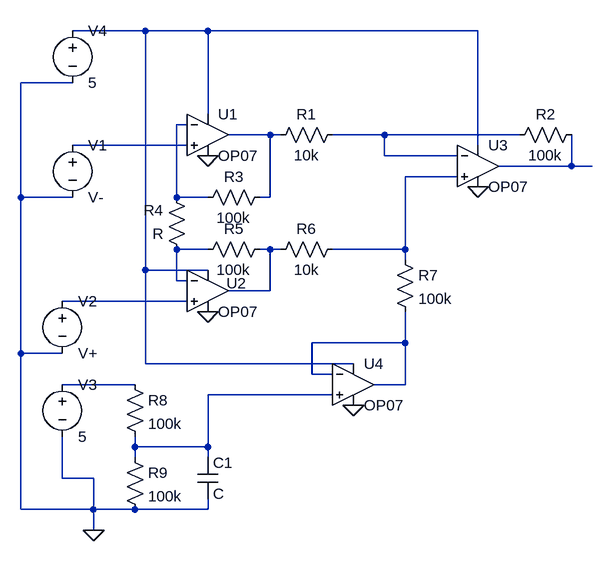
[diagram p0: schematic 4_instrumentation_amplifier.asc]
4_instrumentation_amplifier.asc, the LTspice schematic file:
Version 4.1
SHEET 1 880 864
WIRE -16 -80 -128 -80
WIRE 80 -80 -16 -80
WIRE 496 -80 80 -80
WIRE -128 0 -208 0
WIRE 80 48 80 -80
WIRE 48 64 32 64
WIRE 176 80 112 80
WIRE 192 80 176 80
WIRE 352 80 272 80
WIRE 560 80 352 80
WIRE 48 96 -128 96
WIRE 496 96 496 -80
WIRE 352 112 352 80
WIRE 464 112 352 112
WIRE 640 128 640 80
WIRE 640 128 528 128
WIRE 672 128 640 128
WIRE 464 144 384 144
WIRE -208 176 -208 0
WIRE -128 176 -208 176
WIRE 32 176 32 64
WIRE 80 176 32 176
WIRE 176 176 176 80
WIRE 176 176 160 176
WIRE 80 256 32 256
WIRE 176 256 160 256
WIRE 192 256 176 256
WIRE 384 256 384 144
WIRE 384 256 272 256
WIRE 384 272 384 256
WIRE -16 288 -16 -80
WIRE 80 288 -16 288
WIRE 32 304 32 256
WIRE 48 304 32 304
WIRE 176 320 176 256
WIRE 176 320 112 320
WIRE 48 336 -144 336
WIRE 384 400 384 352
WIRE 384 400 240 400
WIRE -208 416 -208 176
WIRE -144 416 -208 416
WIRE -16 432 -16 288
WIRE 304 432 -16 432
WIRE 240 448 240 400
WIRE 272 448 240 448
WIRE -32 464 -144 464
WIRE 384 464 384 400
WIRE 384 464 336 464
WIRE 272 480 80 480
WIRE -32 560 -32 544
WIRE 80 560 80 480
WIRE 80 560 -32 560
WIRE -32 576 -32 560
WIRE 80 576 80 560
WIRE -144 608 -144 544
WIRE -96 608 -144 608
WIRE -208 656 -208 416
WIRE -96 656 -96 608
WIRE -96 656 -208 656
WIRE -32 656 -96 656
WIRE 80 656 80 640
WIRE 80 656 -32 656
WIRE -96 688 -96 656
FLAG -96 688 0
FLAG 80 112 0
FLAG 80 352 0
FLAG 496 160 0
FLAG 304 496 0
SYMBOL OpAmps\\OP07 80 16 R0
SYMATTR InstName U1
SYMBOL OpAmps\\OP07 80 256 R0
WINDOW 0 29 52 Left 2
SYMATTR InstName U2
SYMBOL OpAmps\\OP07 496 64 R0
SYMATTR InstName U3
SYMBOL OpAmps\\OP07 304 400 R0
SYMATTR InstName U4
SYMBOL voltage -128 80 R0
SYMATTR InstName V1
SYMATTR Value V-
SYMBOL voltage -144 320 R0
SYMATTR InstName V2
SYMATTR Value V+
SYMBOL res 288 64 R90
WINDOW 0 0 56 VBottom 2
WINDOW 3 32 56 VTop 2
SYMATTR InstName R1
SYMATTR Value 10k
SYMBOL res 656 64 R90
WINDOW 0 0 56 VBottom 2
WINDOW 3 32 56 VTop 2
SYMATTR InstName R2
SYMATTR Value 100k
SYMBOL res 176 160 R90
WINDOW 0 0 56 VBottom 2
WINDOW 3 32 56 VTop 2
SYMATTR InstName R3
SYMATTR Value 100k
SYMBOL res 48 272 R180
WINDOW 0 36 76 Left 2
WINDOW 3 36 40 Left 2
SYMATTR InstName R4
SYMBOL res 64 272 R270
WINDOW 0 32 56 VTop 2
WINDOW 3 0 56 VBottom 2
SYMATTR InstName R5
SYMATTR Value 100k
SYMBOL res 176 272 R270
WINDOW 0 32 56 VTop 2
WINDOW 3 0 56 VBottom 2
SYMATTR InstName R6
SYMATTR Value 10k
SYMBOL res 368 256 R0
SYMATTR InstName R7
SYMATTR Value 100k
SYMBOL res -48 448 R0
SYMATTR InstName R8
SYMATTR Value 100k
SYMBOL res -48 560 R0
SYMATTR InstName R9
SYMATTR Value 100k
SYMBOL cap 64 576 R0
SYMATTR InstName C1
SYMBOL voltage -144 448 R0
WINDOW 123 0 0 Left 0
WINDOW 39 0 0 Left 0
SYMATTR InstName V3
SYMATTR Value 5
SYMBOL voltage -128 -96 R0
WINDOW 123 0 0 Left 0
WINDOW 39 0 0 Left 0
SYMATTR InstName V4
SYMATTR Value 5

The netlist it stands for:
* 4_instrumentation_amplifier.asc
X§U1 N005 N002 N001 0 N003 LT1001  ; OP07, pins In+ In- V+ V- OUT
X§U2 N010 N008 N001 0 N009 LT1001  ; OP07, pins In+ In- V+ V- OUT
X§U3 N007 N004 N001 0 N006 LT1001  ; OP07, pins In+ In- V+ V- OUT
X§U4 N013 N011 N001 0 N011 LT1001  ; OP07, pins In+ In- V+ V- OUT
V1 N005 0 V-
V2 N010 0 V+
R1 N004 N003 10k
R2 N006 N004 100k
R3 N003 N002 100k
R4 N008 N002 R
R5 N008 N009 100k
R6 N009 N007 10k
R7 N007 N011 100k
R8 N012 N013 100k
R9 N013 0 100k
C1 N013 0 C
V3 N012 0 5
V4 N001 0 5
.lib LTC.lib
.backanno
.end